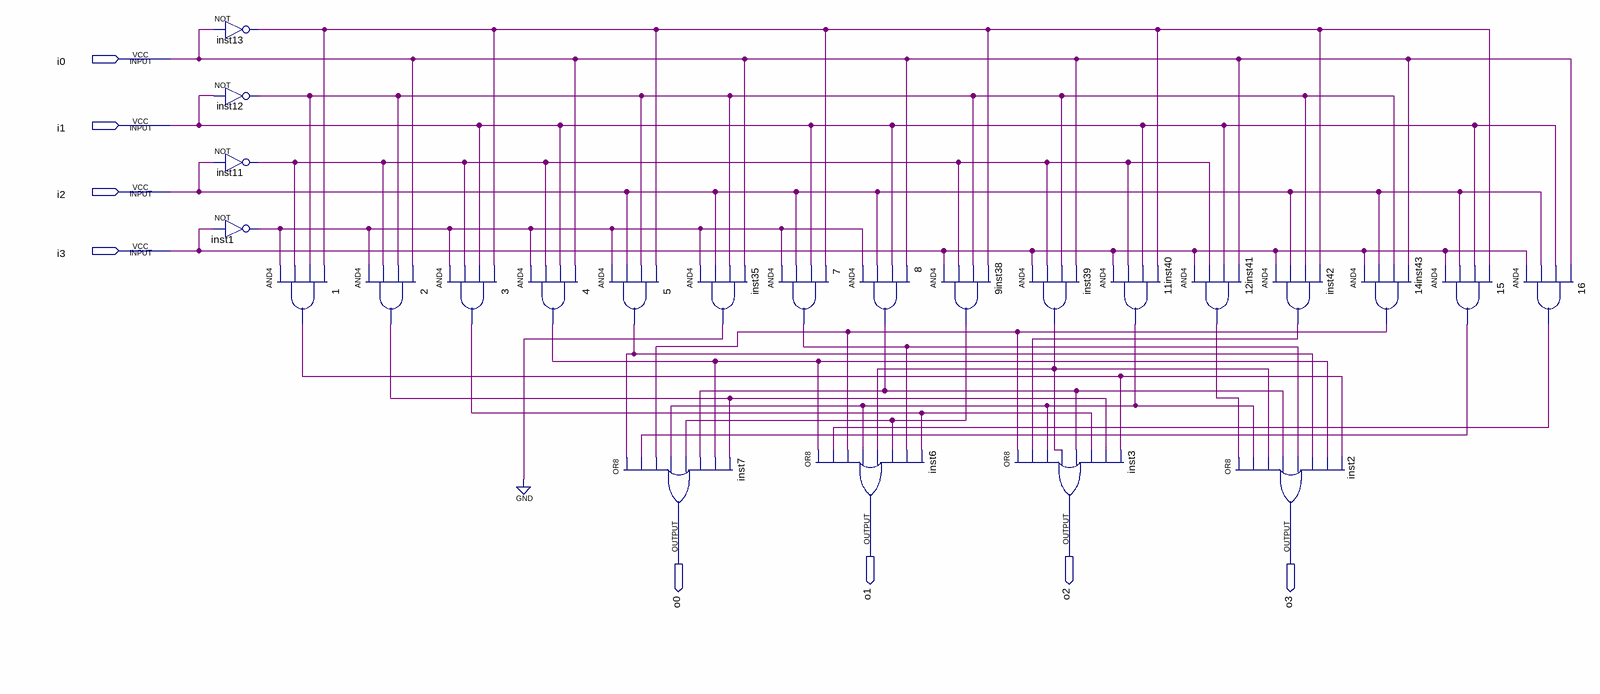
[diagram p0: schematic sheet]
// Quartus schematic SBox.bdf as structural Verilog: 24 symbols, 8 pins
module SBox (
  input  i0,
  input  i1,
  input  i2,
  input  i3,
  output o1,
  output o2,
  output o0,
  output o3
);

  wire inst1_out, inst11_out, inst12_out, inst13_out, inst35_out, inst39_out, inst42_out, n1_out, n2_out,
       n3_out, n4_out, n5_out, n7_out, n8_out, n9inst38_out, n11inst40_out, n12inst41_out, n14inst43_out,
       n15_out, n16_out;

  not inst13 (inst13_out, i0);
  not inst12 (inst12_out, i1);
  not inst11 (inst11_out, i2);
  not inst1 (inst1_out, i3);
  and u_1 (n1_out, inst1_out, inst11_out, inst12_out, inst13_out);
  and u_2 (n2_out, inst1_out, inst11_out, inst12_out, i0);
  and u_3 (n3_out, inst1_out, inst11_out, i1, inst13_out);
  and u_4 (n4_out, inst1_out, inst11_out, i1, i0);
  and u_5 (n5_out, inst1_out, i2, inst12_out, inst13_out);
  or inst7 (o0, n5_out, n15_out, n14inst43_out, n11inst40_out, n9inst38_out, n8_out, n4_out, n2_out);
  and inst35 (inst35_out, inst1_out, i2, inst12_out, i0);
  and u_7 (n7_out, inst1_out, i2, i1, inst13_out);
  or inst6 (o1, n4_out, n16_out, n14inst43_out, n11inst40_out, inst39_out, n9inst38_out, n7_out, n3_out);
  and u_8 (n8_out, inst1_out, i2, i1, i0);
  and u_9inst38 (n9inst38_out, i3, inst11_out, inst12_out, inst13_out);
  or inst3 (o2, n14inst43_out, inst42_out, n11inst40_out, inst39_out, n8_out, n3_out, n2_out, n1_out);
  and inst39 (inst39_out, i3, inst11_out, inst12_out, i0);
  and u_11inst40 (n11inst40_out, i3, inst11_out, i1, inst13_out);
  and u_12inst41 (n12inst41_out, i3, inst11_out, i1, i0);
  or inst2 (o3, n12inst41_out, n11inst40_out, inst39_out, n8_out, n7_out, n5_out, n4_out, n1_out);
  and inst42 (inst42_out, i3, i2, inst12_out, inst13_out);
  and u_14inst43 (n14inst43_out, i3, i2, inst12_out, i0);
  and u_15 (n15_out, i3, i2, i1, inst13_out);
  and u_16 (n16_out, i3, i2, i1, i0);
  // also tied to GND on the sheet: inst35_out
endmodule
